# Altium schematic sheet 0058_DISPLAY SHIFT-POWE.SchDoc
size 848 x 558 mm
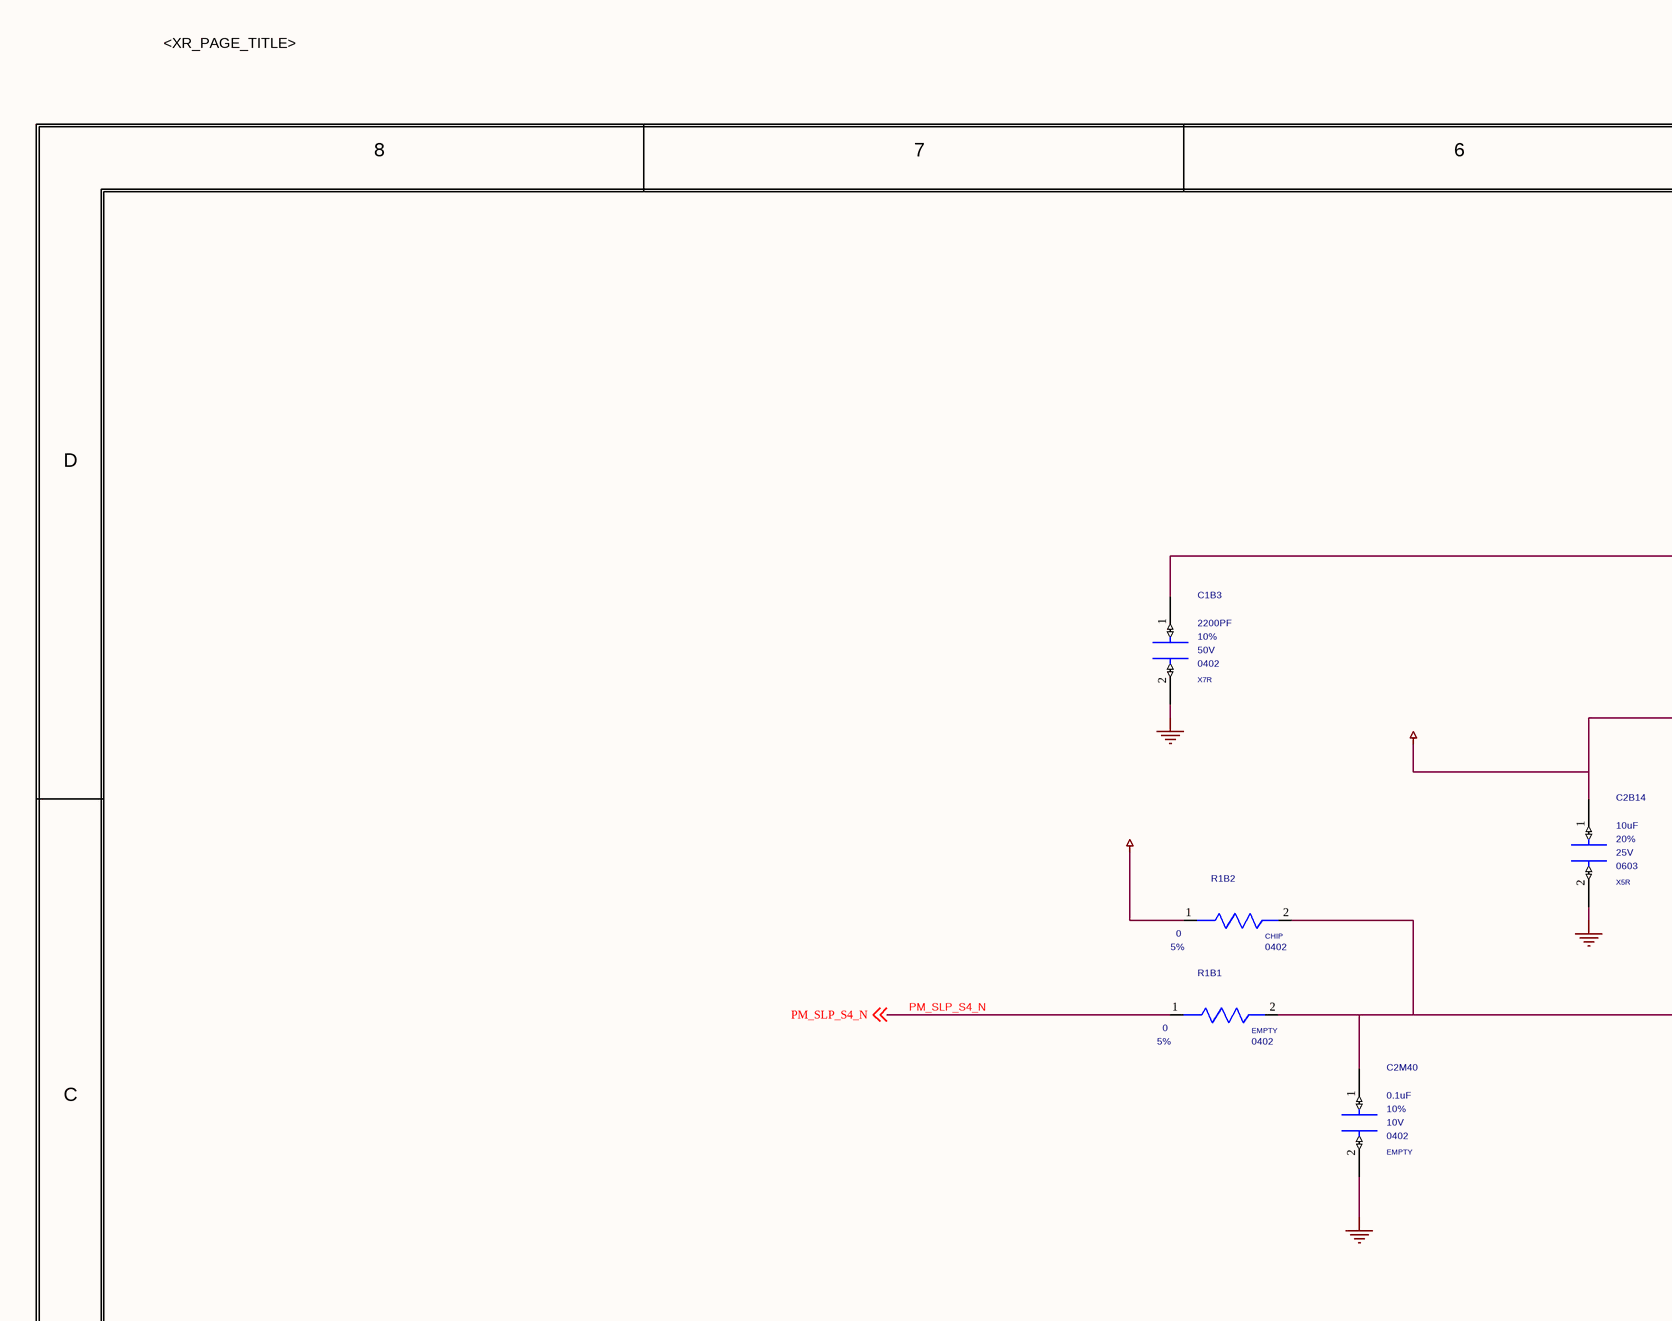
[diagram p0: 0058_DISPLAY SHIFT-POWE.SchDoc, top left]
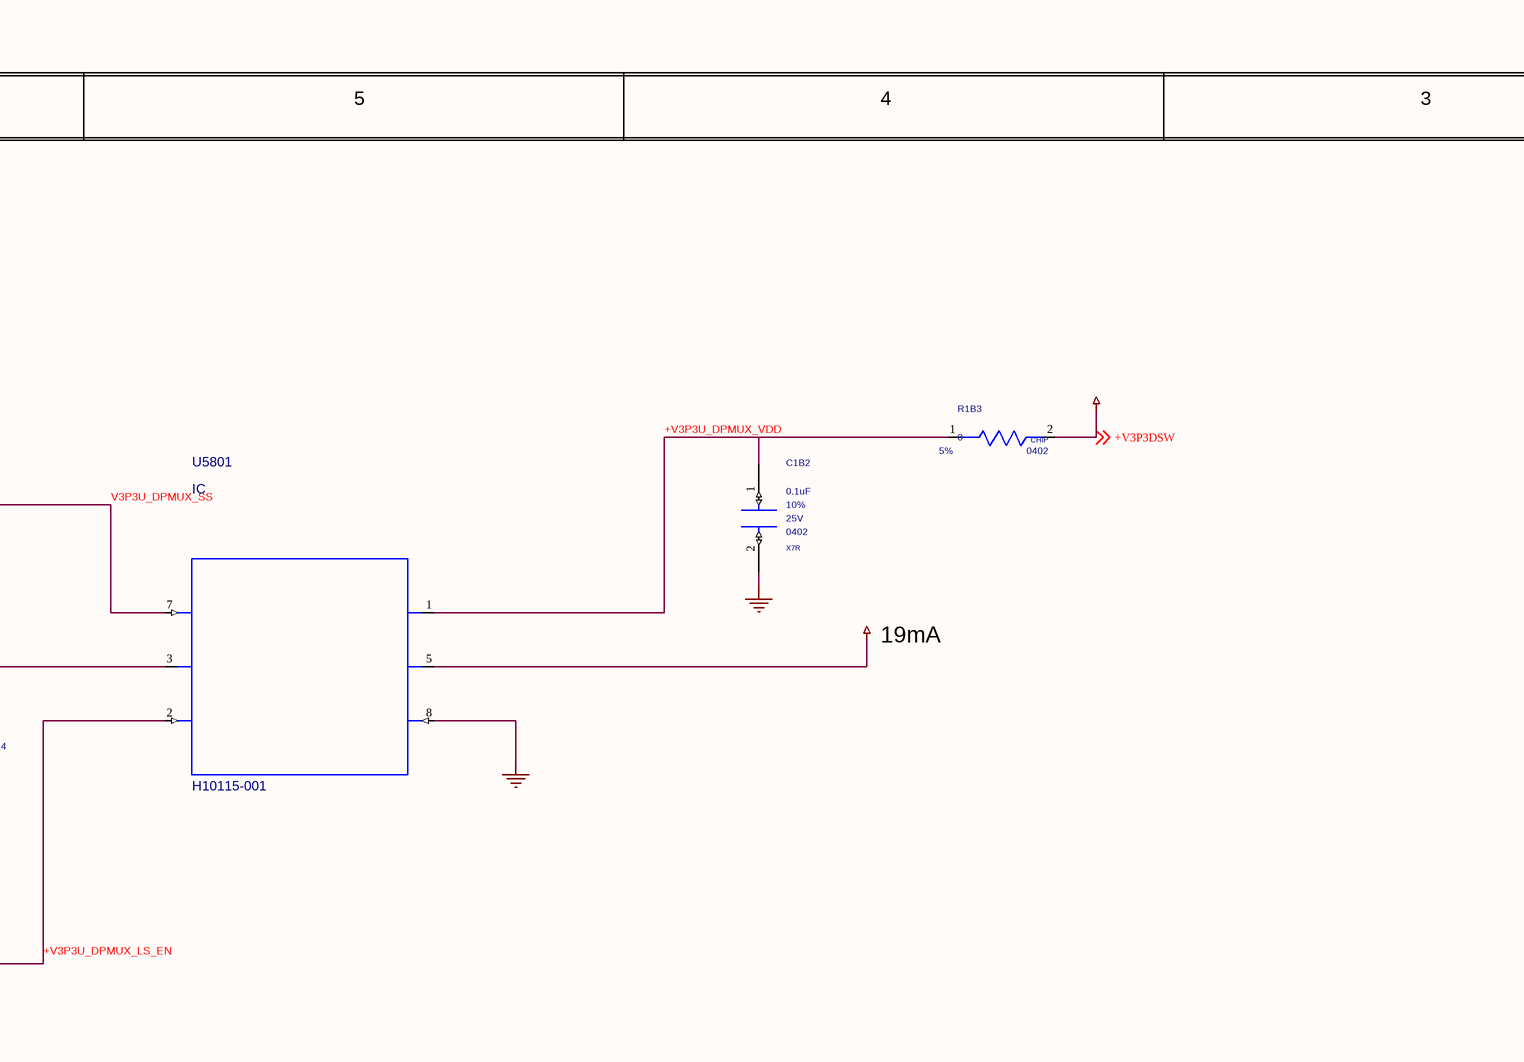
[diagram p1: 0058_DISPLAY SHIFT-POWE.SchDoc, top middle]
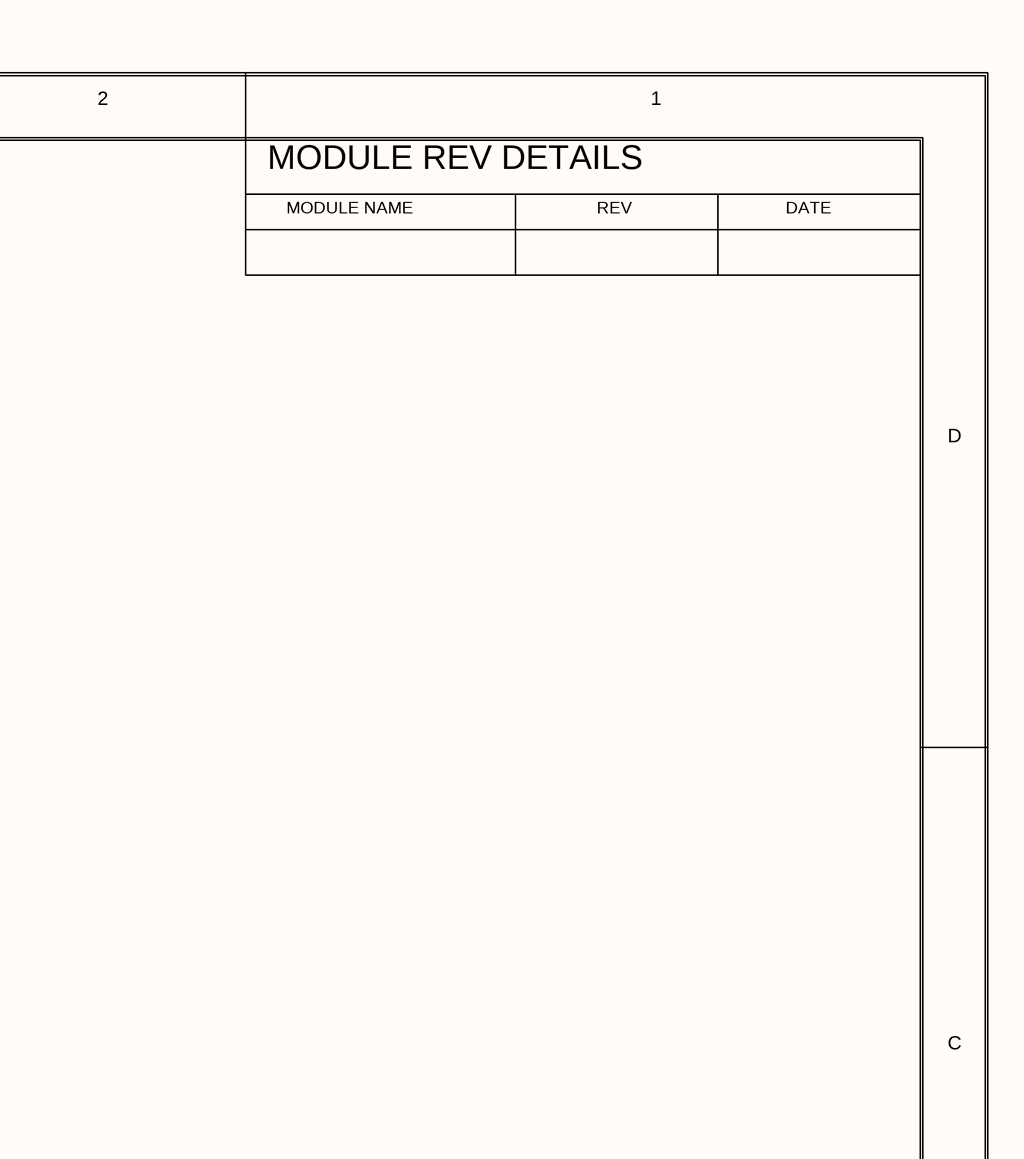
[diagram p2: 0058_DISPLAY SHIFT-POWE.SchDoc, top right]
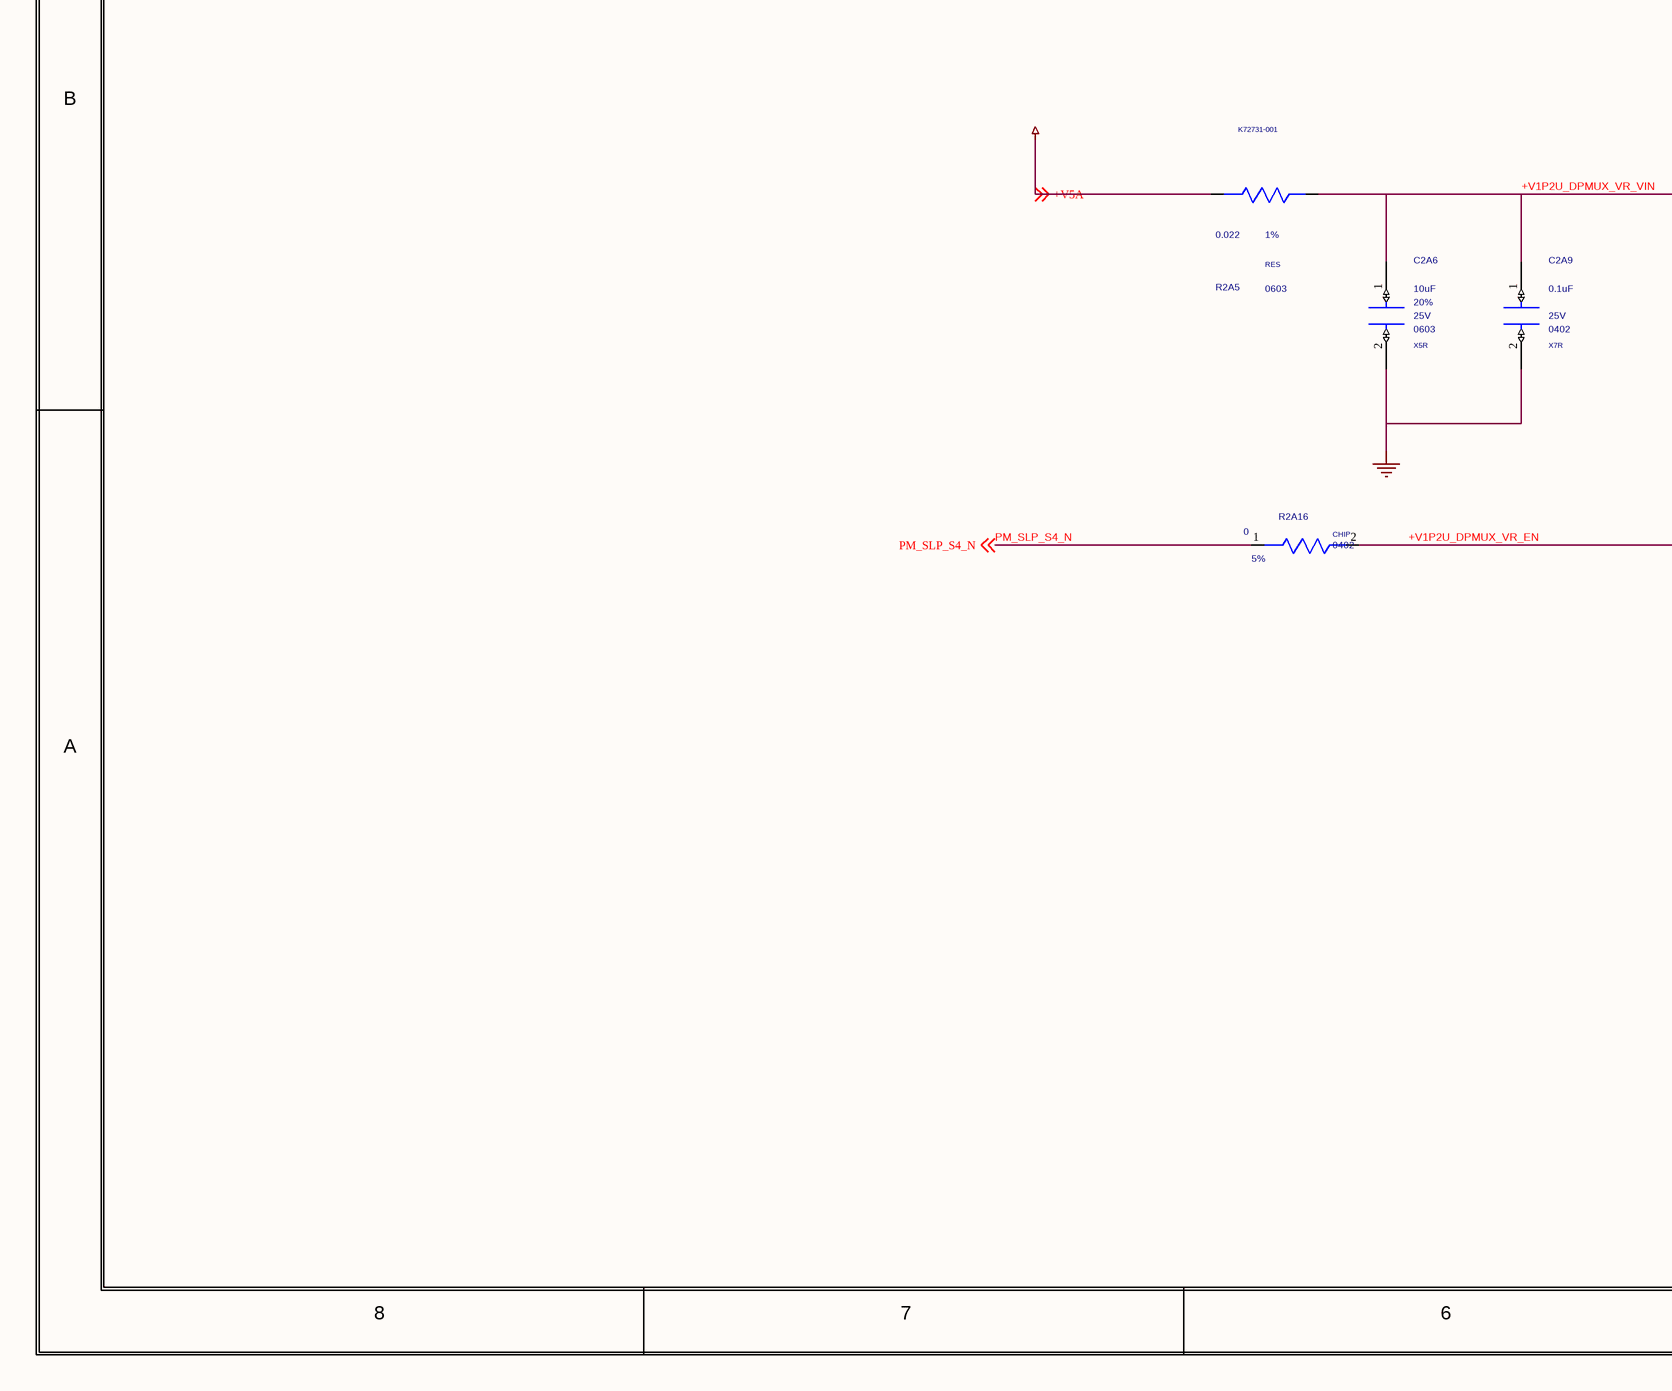
[diagram p3: 0058_DISPLAY SHIFT-POWE.SchDoc, bottom left]
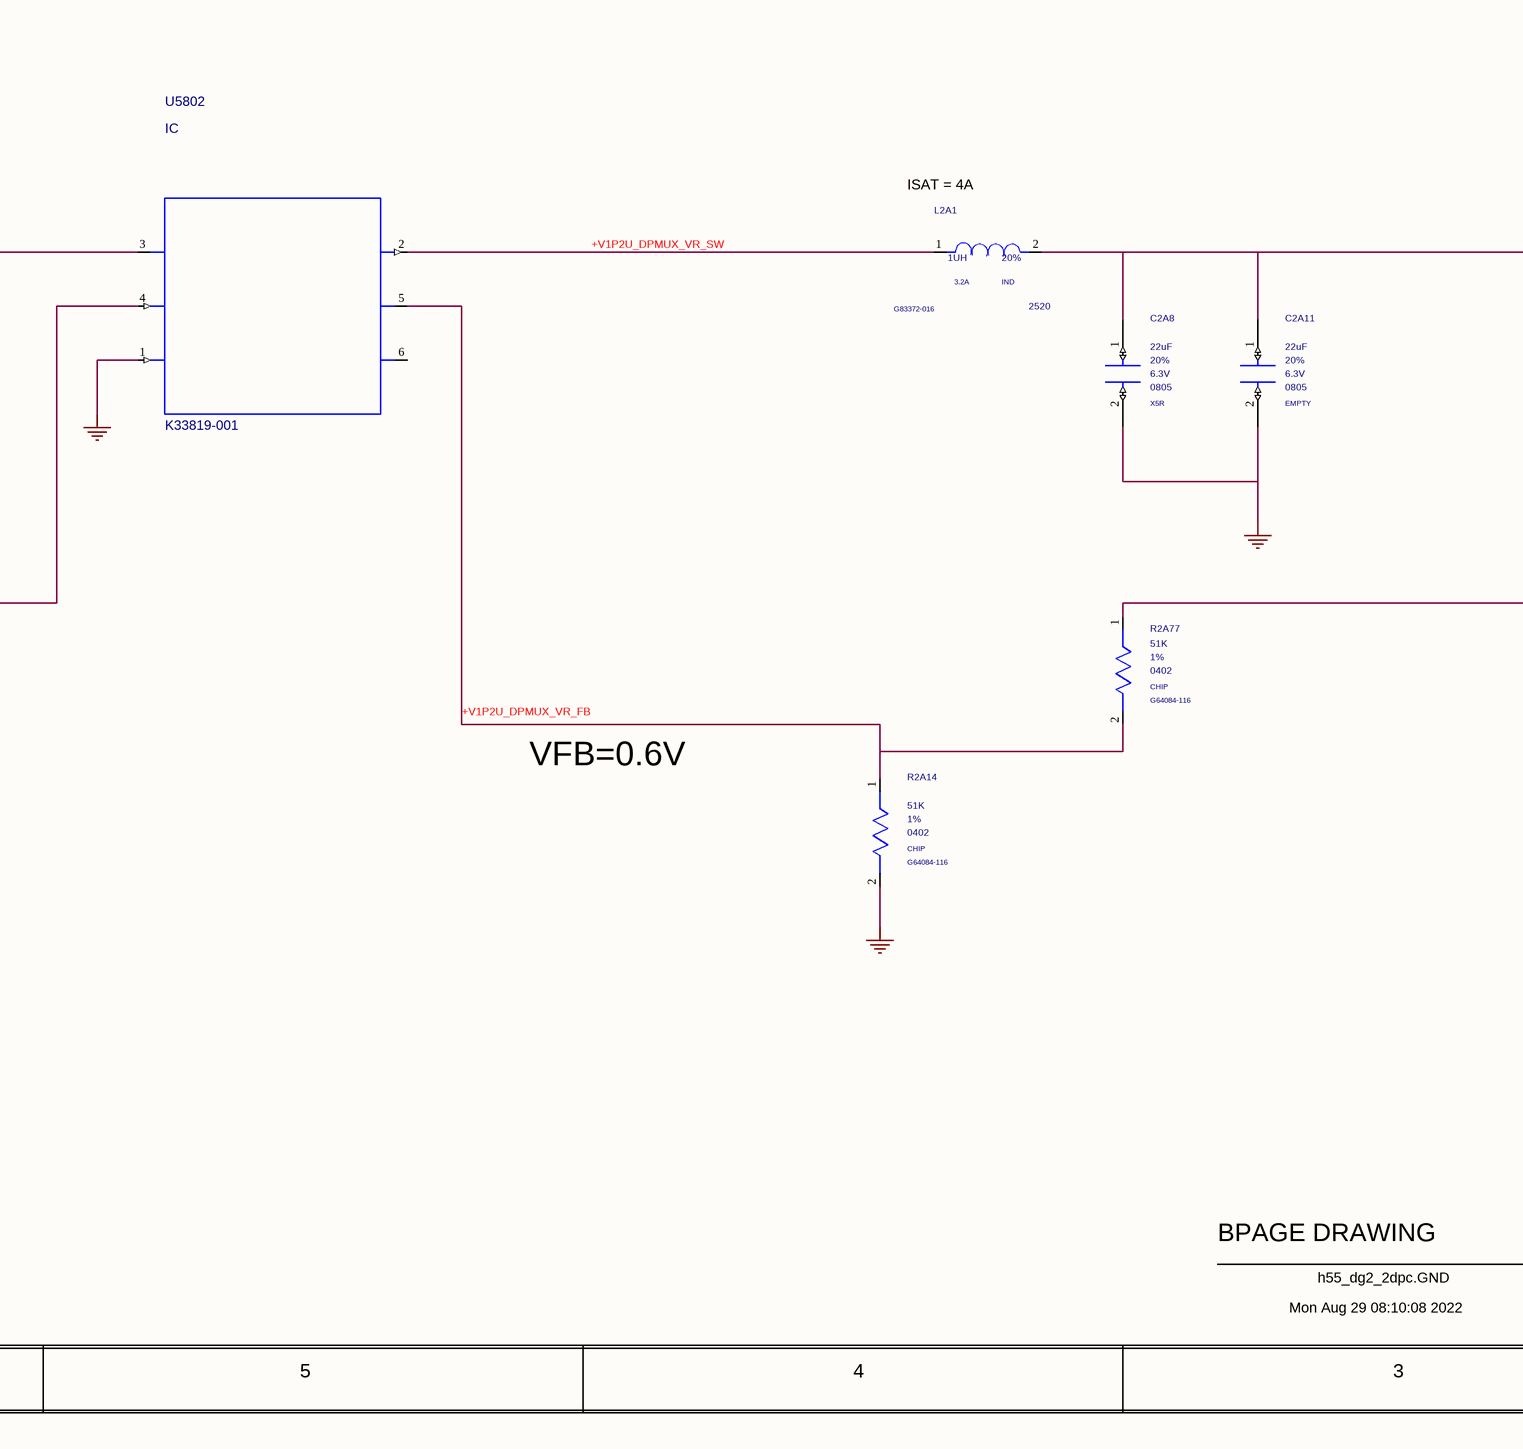
[diagram p4: 0058_DISPLAY SHIFT-POWE.SchDoc, bottom middle]
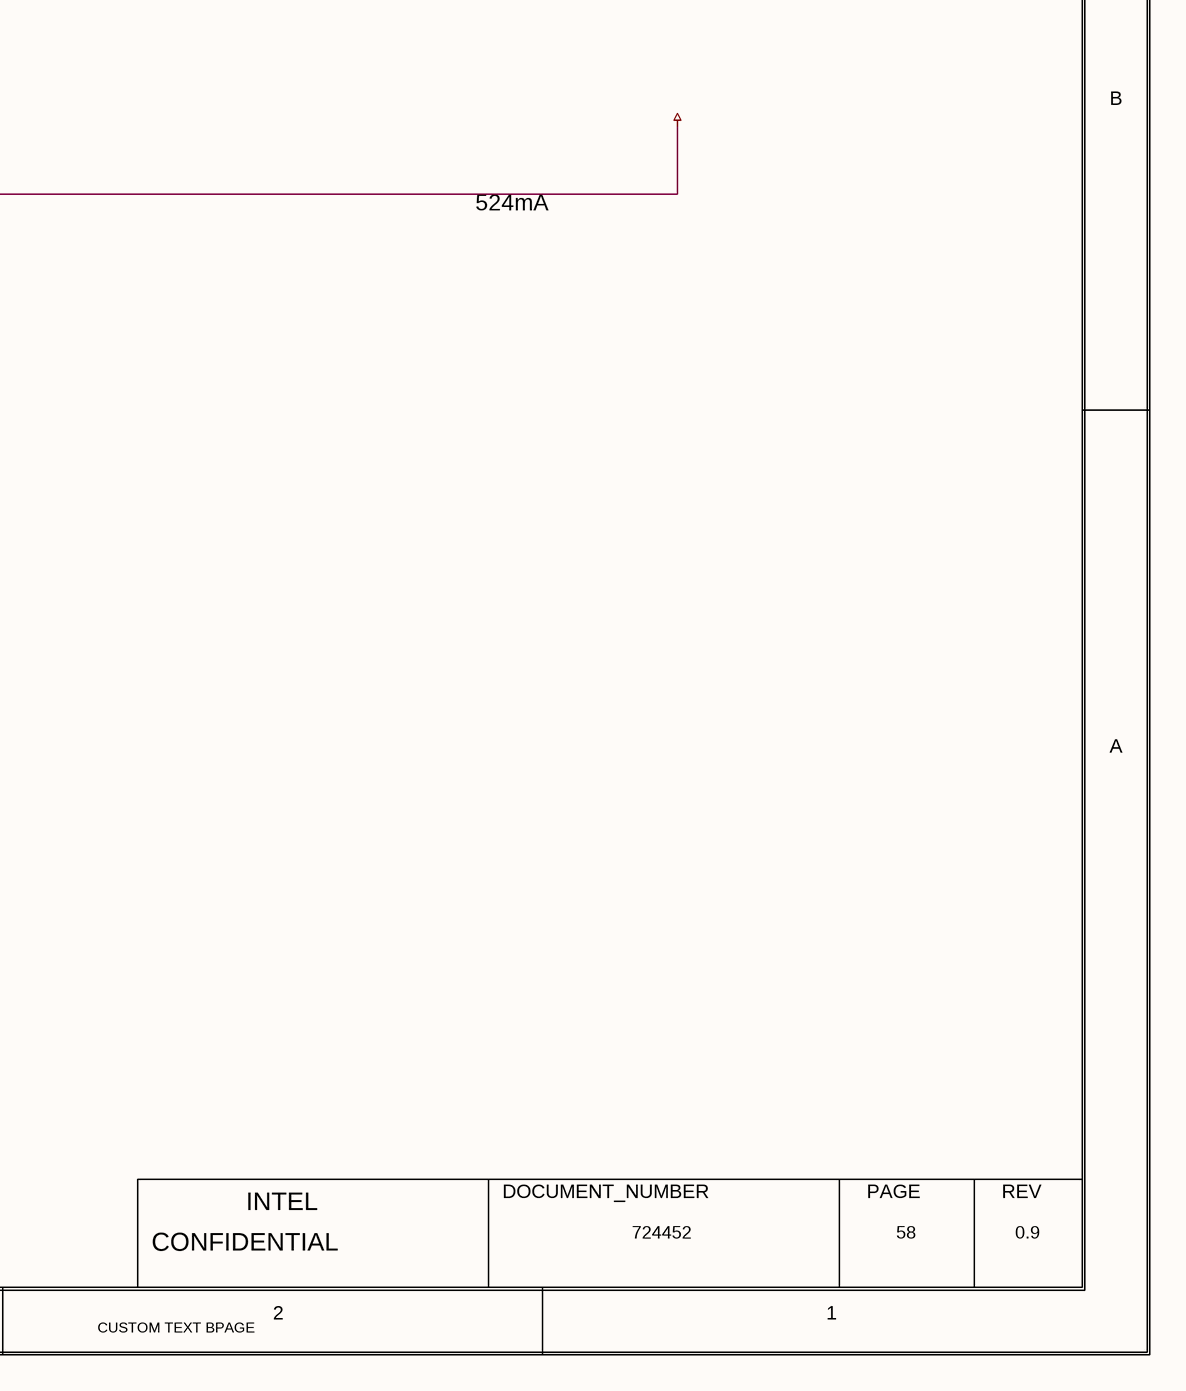
[diagram p5: 0058_DISPLAY SHIFT-POWE.SchDoc, bottom right]

## Parts
C1B2  0.1uF  MATERIAL: X7R  PACK_TYPE: 0402  TOLERANCE: 10%  VOLTAGE: 25V  [SMC0402IA]
C1B3  2200PF  MATERIAL: X7R  PACK_TYPE: 0402  TOLERANCE: 10%  VOLTAGE: 50V  [SMC0402IA]
C2A6  10uF  MATERIAL: X5R  PACK_TYPE: 0603  TOLERANCE: 20%  VOLTAGE: 25V  [SMC0603IA]
C2A8  22uF  MATERIAL: X5R  PACK_TYPE: 0805  TOLERANCE: 20%  VOLTAGE: 6.3V  [SMC0805MA]
C2A9  0.1uF  MATERIAL: X7R  PACK_TYPE: 0402  VOLTAGE: 25V  [SMC0402IA]
C2A11  22uF  MATERIAL: EMPTY  PACK_TYPE: 0805  TOLERANCE: 20%  VOLTAGE: 6.3V  [SMC0805MA]
C2B14  10uF  MATERIAL: X5R  PACK_TYPE: 0603  TOLERANCE: 20%  VOLTAGE: 25V  [SMC0603IA]
C2M40  0.1uF  MATERIAL: EMPTY  PACK_TYPE: 0402  TOLERANCE: 10%  VOLTAGE: 10V  [SMC0402IA]
L2A1  1UH  CURRENT: 3.2A  MATERIAL: IND  PACK_TYPE: 2520  PART_NUMBER: G83372-016  TOLERANCE: 20%  [SMI2520MD]
R1B1  0  MATERIAL: EMPTY  PACK_TYPE: 0402  TOLERANCE: 5%  [SMR0402IA]
R1B2  0  MATERIAL: CHIP  PACK_TYPE: 0402  TOLERANCE: 5%  [SMR0402IA]
R1B3  0  MATERIAL: CHIP  PACK_TYPE: 0402  TOLERANCE: 5%  [SMR0402IA]
R2A5  0.022  MATERIAL: RES  PACK_TYPE: 0603  PART_NUMBER: K72731-001  TOLERANCE: 1%  [CTK0_SM0603_1800X1014_MA]
R2A14  51K  MATERIAL: CHIP  PACK_TYPE: 0402  PART_NUMBER: G64084-116  TOLERANCE: 1%  [SMR0402IA]
R2A16  0  MATERIAL: CHIP  PACK_TYPE: 0402  TOLERANCE: 5%  [SMR0402IA]
R2A77  51K  MATERIAL: CHIP  PACK_TYPE: 0402  PART_NUMBER: G64084-116  TOLERANCE: 1%  [SMR0402IA]
U5801  MATERIAL: IC  PART_NUMBER: H10115-001  [CTK2_LCC8_1050X1650_400_MA]  (hidden comment: C_SLG5NT1458V)
U5802  MATERIAL: IC  PART_NUMBER: K33819-001  [CTK2_SOT563_6_1300X1700_500_MA]  (hidden comment: C_TLV62585)

## Nets
+V1P2U_DPMUX0: C2A8.1(A) C2A11.1(A) L2A1.2(INB) R1B2.1(A) R2A77.1(A)
+V3P3DSW: C2B14.1(A) R1B3.2(B) U5801.3(D) ; off-sheet +V3P3DSW
+V3P3U_DPMUX0: U5801.5(S)
+V5A: R2A5.1(A) ; off-sheet +V5A
GND: C1B2.2(B) C1B3.2(B) C2A6.2(B) C2A8.2(B) C2A9.2(B) C2A11.2(B) C2B14.2(B) C2M40.2(B) R2A14.2(B) U5801.8(GND) U5802.1(GND)
+V1P2U_DPMUX_VR_EN: R2A16.2(B) U5802.4(EN)
+V1P2U_DPMUX_VR_FB: R2A14.1(A) R2A77.2(B) U5802.5(FB)
+V1P2U_DPMUX_VR_SW: L2A1.1(INA) U5802.2(SW)
+V1P2U_DPMUX_VR_VIN: C2A6.1(A) C2A9.1(A) R2A5.2(B) U5802.3(VIN)
+V3P3U_DPMUX_LS_EN: C2M40.1(A) R1B1.2(B) R1B2.2(B) U5801.2(ON)
+V3P3U_DPMUX_VDD: C1B2.1(A) R1B3.1(A) U5801.1(VDD)
PM_SLP_S4_N: R1B1.1(A) R2A16.1(A) ; off-sheet PM_SLP_S4_N
V3P3U_DPMUX_SS: C1B3.1(A) U5801.7(CAP)

Not connected (* = marked no-connect by the designer): U5802 6(NC)

## Notes on the sheet
- <XR_PAGE_TITLE>
- 8
- 7
- 6
- 5
- 4
- 3
- 2
- 1
- MODULE REV DETAILS
- MODULE NAME
- REV
- DATE
- D
- 19mA
- C
- B
- ISAT = 4A
- 524mA
- VFB=0.6V
- A
- BPAGE DRAWING
- INTEL
- DOCUMENT_NUMBER
- PAGE
- Mon Aug 29 08:10:08 2022
- h55_dg2_2dpc.GND
- CONFIDENTIAL
- 724452
- 58
- 0.9
- CUSTOM TEXT BPAGE

## Library data of the parts
C1B2 = CAP: PART_NUMBER: A36096-112; CDS_PHYS_PART_NAME: CAP_0402-A36096-112,X7R,0.1UF,25V,10%,LPDB,GENERIC; OriginalSymbolOrigin: (-50,25); XY: (6575,4425); VER: 1; ROT: 0; PHYS_PAGE: 58; LOCATION: C1B2; DRAWING: @RVP1_ADL_SB_ADP_S_DDR5_SODIMM_2DPC_LIB.H55_DG2_2DPC(SCH_1):PAGE58; CDS_LIB: discrete; PCB Footprint: SMC0402IA; CHIPS_PART_NAME: CAP; CDS_PART_NAME: CAP_0402-A36096-112,X7R,0.1UF,25V,10%,LPDB,GENERIC; CDS_LOCATION: C1B2; ASI_MODEL: A36096-112
C1B3 = CAP: PART_NUMBER: A36096-075; CDS_PHYS_PART_NAME: CAP_0402-A36096-075,X7R,2200PF,50V,10%,LPDB,GENERIC; OriginalSymbolOrigin: (-50,25); XY: (4300,4275); VER: 1; ROT: 0; PHYS_PAGE: 58; LOCATION: C1B3; DRAWING: @RVP1_ADL_SB_ADP_S_DDR5_SODIMM_2DPC_LIB.H55_DG2_2DPC(SCH_1):PAGE58; CDS_LIB: discrete; PCB Footprint: SMC0402IA; CHIPS_PART_NAME: CAP; CDS_PART_NAME: CAP_0402-A36096-075,X7R,2200PF,50V,10%,LPDB,GENERIC; CDS_LOCATION: C1B3; ASI_MODEL: A36096-075
C2A6 = CAP: PART_NUMBER: G33975-001; CDS_PHYS_PART_NAME: CAP_0603-G33975-001,X5R,10UF,25V,20%,LPDB,GENERIC; OriginalSymbolOrigin: (-50,25); XY: (4700,1925); VER: 1; ROT: 0; PHYS_PAGE: 58; LOCATION: C2A6; IP: GENERIC; FP_TECH: LPDB; DRAWING: @RVP1_ADL_SB_ADP_S_DDR5_SODIMM_2DPC_LIB.H55_DG2_2DPC(SCH_1):PAGE58; CDS_LIB: discrete; PCB Footprint: SMC0603IA; SEC_TYPE: 0603; CHIPS_PART_NAME: CAP; CDS_PART_NAME: CAP_0603-G33975-001,X5R,10UF,25V,20%,LPDB,GENERIC; CDS_LOCATION: C2A6; ASI_MODEL: G33975-001
C2A8 = CAP: PART_NUMBER: 644066-070; CDS_PHYS_PART_NAME: CAP_0805-644066-070,X5R,22UF,6.3V,20%,LPDB,GENERIC; OriginalSymbolOrigin: (-50,25); XY: (7325,1925); VER: 1; ROT: 0; PHYS_PAGE: 58; LOCATION: C2A8; DRAWING: @RVP1_ADL_SB_ADP_S_DDR5_SODIMM_2DPC_LIB.H55_DG2_2DPC(SCH_1):PAGE58; CDS_LIB: discrete; PCB Footprint: SMC0805MA; SEC_TYPE: 0805; CHIPS_PART_NAME: CAP; CDS_PART_NAME: CAP_0805-644066-070,X5R,22UF,6.3V,20%,LPDB,GENERIC; CDS_LOCATION: C2A8; ASI_MODEL: 644066-070
C2A9 = CAP: PART_NUMBER: A36096-112; CDS_PHYS_PART_NAME: CAP_0402-A36096-112,X7R,0.1UF,25V,10%,LPDB,GENERIC; TOLERANCE: 10%; OriginalSymbolOrigin: (-50,25); XY: (4950,1925); VER: 1; ROT: 0; PHYS_PAGE: 58; LOCATION: C2A9; IP: GENERIC; FP_TECH: LPDB; DRAWING: @RVP1_ADL_SB_ADP_S_DDR5_SODIMM_2DPC_LIB.H55_DG2_2DPC(SCH_1):PAGE58; CDS_LIB: discrete; PCB Footprint: SMC0402IA; SEC_TYPE: 0402; CHIPS_PART_NAME: CAP; CDS_PART_NAME: CAP_0402-A36096-112,X7R,0.1UF,25V,10%,LPDB,GENERIC; CDS_LOCATION: C2A9; ASI_MODEL: A36096-112
C2A11 = CAP: PART_NUMBER: 644066-070; CDS_PHYS_PART_NAME: CAP_0805-644066-070,EMPTY,22UF,6.3V,20%,LPDB,GENERIC; OriginalSymbolOrigin: (-50,25); XY: (7575,1925); VER: 1; ROT: 0; PHYS_PAGE: 58; LOCATION: C2A11; DRAWING: @RVP1_ADL_SB_ADP_S_DDR5_SODIMM_2DPC_LIB.H55_DG2_2DPC(SCH_1):PAGE58; CDS_LIB: discrete; PCB Footprint: SMC0805MA; CHIPS_PART_NAME: CAP; CDS_PART_NAME: CAP_0805-644066-070,EMPTY,22UF,6.3V,20%,LPDB,GENERIC; CDS_LOCATION: C2A11; ASI_MODEL: 644066-070
C2B14 = CAP: PART_NUMBER: G33975-001; CDS_PHYS_PART_NAME: CAP_0603-G33975-001,X5R,10UF,25V,20%,LPDB,GENERIC; OriginalSymbolOrigin: (-50,25); XY: (5075,3900); VER: 1; ROT: 0; PHYS_PAGE: 58; LOCATION: C2B14; IP: GENERIC; FP_TECH: LPDB; DRAWING: @RVP1_ADL_SB_ADP_S_DDR5_SODIMM_2DPC_LIB.H55_DG2_2DPC(SCH_1):PAGE58; CDS_LIB: discrete; PCB Footprint: SMC0603IA; CHIPS_PART_NAME: CAP; CDS_PART_NAME: CAP_0603-G33975-001,X5R,10UF,25V,20%,LPDB,GENERIC; CDS_LOCATION: C2B14; ASI_MODEL: G33975-001
C2M40 = CAP: PART_NUMBER: A36096-035; CDS_PHYS_PART_NAME: CAP_0402-A36096-035,EMPTY,0.1UF,10V,10%,LPDB,GENERIC; OriginalSymbolOrigin: (-50,25); XY: (4650,3400); VER: 1; ROT: 0; PHYS_PAGE: 58; LOCATION: C2M40; IP: GENERIC; FP_TECH: LPDB; DRAWING: @RVP1_ADL_SB_ADP_S_DDR5_SODIMM_2DPC_LIB.H55_DG2_2DPC(SCH_1):PAGE58; CDS_LIB: discrete; ASI_MODEL: A36096-112; PCB Footprint: SMC0402IA; CHIPS_PART_NAME: CAP; CDS_PART_NAME: CAP_0402-A36096-035,EMPTY,0.1UF,10V,10%,LPDB,GENERIC; CDS_LOCATION: C2M40
L2A1 = INDUCTOR: CDS_PHYS_PART_NAME: INDUCTOR_2520-G83372-016,IND,1UH,20%,3.2A,LPDB,GENERIC; CDS_LMAN_SYM_OUTLINE: -75,25,75,-25; OriginalSymbolOrigin: (-75,25); XY: (7075,2150); VER: 1; ROT: 0; PHYS_PAGE: 58; LOCATION: L2A1; IP: GENERIC; FP_TECH: LPDB; DRAWING: @RVP1_ADL_SB_ADP_S_DDR5_SODIMM_2DPC_LIB.H55_DG2_2DPC(SCH_1):PAGE58; CDS_LIB: discrete; PCB Footprint: SMI2520MD; SEC_TYPE: 2520; CHIPS_PART_NAME: INDUCTOR; CDS_PART_NAME: INDUCTOR_2520-G83372-016,IND,1UH,20%,3.2A,LPDB,GENERIC; CDS_LOCATION: L2A1; ASI_MODEL: G83372-016
R1B1 = RES#1: PART_NUMBER: A93549-001; CHIPS_PART_NAME: RES; CDS_PHYS_PART_NAME: RES_0402-A93549-001,EMPTY,0,5%,1/16W,LPDB,GENERIC; WATTAGE: 1/16W; OriginalSymbolOrigin: (-75,25); XY: (4400,3600); VER: 1; PHYS_PAGE: 58; LOCATION: R1B1; IP: GENERIC; FP_TECH: LPDB; DRAWING: @RVP1_ADL_SB_ADP_S_DDR5_SODIMM_2DPC_LIB.H55_DG2_2DPC(SCH_1):PAGE58; CDS_LIB: discrete; PCB Footprint: SMR0402IA; SEC_TYPE: 0402; ROT: 0; CDS_PART_NAME: RES_0402-A93549-001,EMPTY,0,5%,1/16W,LPDB,GENERIC; CDS_LOCATION: R1B1; ASI_MODEL: A93549-001
R1B2 = RES#1: PART_NUMBER: A93549-001; CHIPS_PART_NAME: RES; CDS_PHYS_PART_NAME: RES_0402-A93549-001,CHIP,0,5%,1/16W,LPDB,GENERIC; WATTAGE: 1/16W; OriginalSymbolOrigin: (-75,25); XY: (4425,3775); VER: 1; PHYS_PAGE: 58; LOCATION: R1B2; IP: GENERIC; FP_TECH: LPDB; DRAWING: @RVP1_ADL_SB_ADP_S_DDR5_SODIMM_2DPC_LIB.H55_DG2_2DPC(SCH_1):PAGE58; CDS_LIB: discrete; PCB Footprint: SMR0402IA; ROT: 0; CDS_PART_NAME: RES_0402-A93549-001,CHIP,0,5%,1/16W,LPDB,GENERIC; CDS_LOCATION: R1B2; ASI_MODEL: A93549-001
R1B3 = RES#1: PART_NUMBER: A93549-001; CHIPS_PART_NAME: RES; CDS_PHYS_PART_NAME: RES_0402-A93549-001,CHIP,0,5%,1/16W,LPDB,GENERIC; WATTAGE: 1/16W; OriginalSymbolOrigin: (-75,25); XY: (7025,4575); VER: 1; PHYS_PAGE: 58; LOCATION: R1B3; DRAWING: @RVP1_ADL_SB_ADP_S_DDR5_SODIMM_2DPC_LIB.H55_DG2_2DPC(SCH_1):PAGE58; CDS_LIB: discrete; PCB Footprint: SMR0402IA; ROT: 0; CDS_PART_NAME: RES_0402-A93549-001,CHIP,0,5%,1/16W,LPDB,GENERIC; CDS_LOCATION: R1B3; ASI_MODEL: A93549-001
R2A5 = C_RES#1: CHIPS_PART_NAME: C_RES; CDS_PHYS_PART_NAME: C_RES_0603-K72731-001,RES,0.022,1%,0.4W,TK0,GENERIC; CDS_LMAN_SYM_OUTLINE: -50,50,50,-50; FP_TECH: TK0; IP: GENERIC; ROOM: NONE; WATTAGE: 0.4W; OriginalSymbolOrigin: (-75,25); XY: (4475,2150); VER: 1; ROT: 0; PHYS_PAGE: 58; LOCATION: R2A5; DRAWING: @RVP1_ADL_SB_ADP_S_DDR5_SODIMM_2DPC_LIB.H55_DG2_2DPC(SCH_1):PAGE58; CDS_LIB: c_discrete; VARIANT: ?; PCB Footprint: CTK0_SM0603_1800X1014_MA; CDS_PART_NAME: C_RES_0603-K72731-001,RES,0.022,1%,0.4W,TK0,GENERIC; CDS_LOCATION: R2A5; ASI_MODEL: K72731-001
R2A14 = RES: CDS_PHYS_PART_NAME: RES_0402-G64084-116,CHIP,51K,1%,1/16W,LPDB,GENERIC; WATTAGE: 1/16W; OriginalSymbolOrigin: (-25,75); XY: (6875,1075); VER: 2; ROT: 0; PHYS_PAGE: 58; LOCATION: R2A14; IP: GENERIC; FP_TECH: LPDB; DRAWING: @RVP1_ADL_SB_ADP_S_DDR5_SODIMM_2DPC_LIB.H55_DG2_2DPC(SCH_1):PAGE58; CDS_LIB: discrete; PCB Footprint: SMR0402IA; CHIPS_PART_NAME: RES; CDS_PART_NAME: RES_0402-G64084-116,CHIP,51K,1%,1/16W,LPDB,GENERIC; CDS_LOCATION: R2A14; ASI_MODEL: G64084-116
R2A16 = RES#1: PART_NUMBER: A93549-001; CHIPS_PART_NAME: RES; CDS_PHYS_PART_NAME: RES_0402-A93549-001,CHIP,0,5%,1/16W,LPDB,GENERIC; WATTAGE: 1/16W; OriginalSymbolOrigin: (-75,25); XY: (4550,1500); VER: 1; PHYS_PAGE: 58; LOCATION: R2A16; IP: GENERIC; FP_TECH: LPDB; DRAWING: @RVP1_ADL_SB_ADP_S_DDR5_SODIMM_2DPC_LIB.H55_DG2_2DPC(SCH_1):PAGE58; CDS_LIB: discrete; PCB Footprint: SMR0402IA; SEC_TYPE: 0402; ROT: 0; CDS_PART_NAME: RES_0402-A93549-001,CHIP,0,5%,1/16W,LPDB,GENERIC; CDS_LOCATION: R2A16; ASI_MODEL: A93549-001
R2A77 = RES: CDS_PHYS_PART_NAME: RES_0402-G64084-116,CHIP,51K,1%,1/16W,LPDB,GENERIC; WATTAGE: 1/16W; OriginalSymbolOrigin: (-25,75); XY: (7325,1375); VER: 2; ROT: 0; PHYS_PAGE: 58; LOCATION: R2A77; IP: GENERIC; FP_TECH: LPDB; DRAWING: @RVP1_ADL_SB_ADP_S_DDR5_SODIMM_2DPC_LIB.H55_DG2_2DPC(SCH_1):PAGE58; CDS_LIB: discrete; PCB Footprint: SMR0402IA; CHIPS_PART_NAME: RES; CDS_PART_NAME: RES_0402-G64084-116,CHIP,51K,1%,1/16W,LPDB,GENERIC; CDS_LOCATION: R2A77; ASI_MODEL: G64084-116
U5801 = C_SLG5NT1458V: CDS_PHYS_PART_NAME: C_SLG5NT1458V_LCC-H10115-001,IC,SLG5NT1458V,TK2,GENERIC; CDS_LMAN_SYM_OUTLINE: -200,200,200,-200; FP_TECH: TK2; IP: GENERIC; PACK_TYPE: LCC; ROOM: NONE; OriginalSymbolOrigin: (-225,200); XY: (5725,4150); VER: 1; ROT: 0; PHYS_PAGE: 58; LOCATION: U5801; DRAWING: @RVP1_ADL_SB_ADP_S_DDR5_SODIMM_2DPC_LIB.H55_DG2_2DPC(SCH_1):PAGE58; CDS_LIB: local; VARIANT: ?; PCB Footprint: CTK2_LCC8_1050X1650_400_MA; SEC_TYPE: LCC; CHIPS_PART_NAME: C_SLG5NT1458V; CDS_PART_NAME: C_SLG5NT1458V_LCC-H10115-001,IC,SLG5NT1458V,TK2,GENERIC; CDS_LOCATION: U5801
U5802 = C_TLV62585: CDS_PHYS_PART_NAME: C_TLV62585_SOT563-K33819-001,IC,TLV62585PDRLT,TK2,GENERIC; CDS_LMAN_SYM_OUTLINE: -200,200,200,-200; FP_TECH: TK2; IP: GENERIC; PACK_TYPE: SOT563; ROOM: NONE; OriginalSymbolOrigin: (-225,200); XY: (5750,2050); VER: 1; ROT: 0; PHYS_PAGE: 58; LOCATION: U5802; DRAWING: @RVP1_ADL_SB_ADP_S_DDR5_SODIMM_2DPC_LIB.H55_DG2_2DPC(SCH_1):PAGE58; CDS_LIB: local; VARIANT: ?; PCB Footprint: CTK2_SOT563_6_1300X1700_500_MA; SEC_TYPE: SOT563; CHIPS_PART_NAME: C_TLV62585; CDS_PART_NAME: C_TLV62585_SOT563-K33819-001,IC,TLV62585PDRLT,TK2,GENERIC; CDS_LOCATION: U5802